# EAGLE schematic bump-sensor (EAGLE 7.2.0)
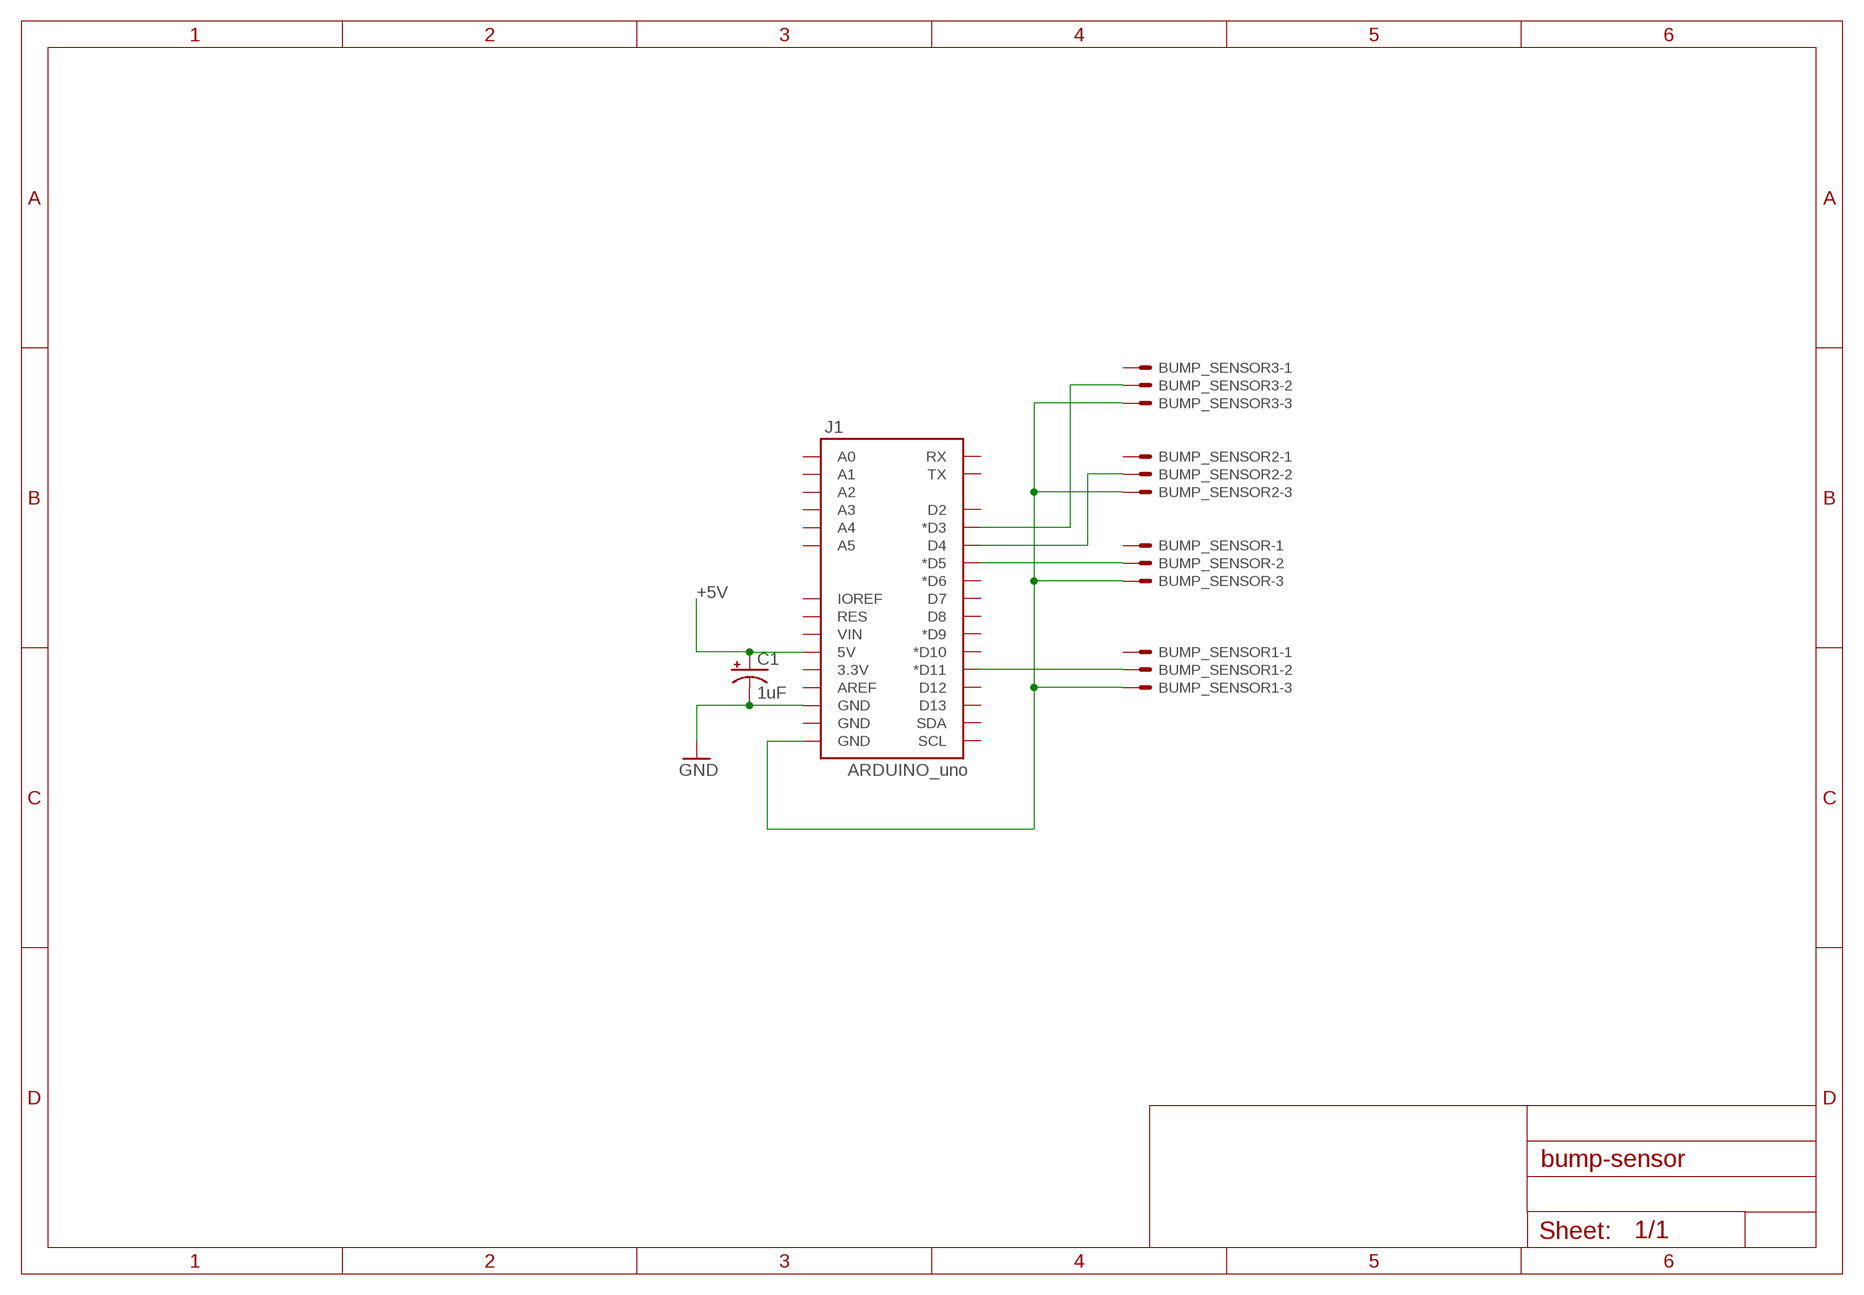
[diagram p0: schematic, sheet 1]

## Parts
BUMP_SENSOR  22-23-2031  [22-23-2031]
BUMP_SENSOR1  22-23-2031  [22-23-2031]
BUMP_SENSOR2  22-23-2031  [22-23-2031]
BUMP_SENSOR3  22-23-2031  [22-23-2031]
C1  1uF  CAP_POL1206  [EIA3216]
J1  ARDUINO_uno  ARDUINO_R3_SHIELD  [UNO_R3_SHIELD]

## Nets
+5V: C1.A(+) J1.5V
GND: C1.C(-) J1.GND@2(GND)
N$1: BUMP_SENSOR1.2 J1.D11(*D11)
N$2: BUMP_SENSOR.2 J1.D5(*D5)
N$3: BUMP_SENSOR1.3 BUMP_SENSOR2.3 BUMP_SENSOR3.3 BUMP_SENSOR.3 J1.GND@0(GND)
N$6: BUMP_SENSOR2.2 J1.D4
N$7: BUMP_SENSOR3.2 J1.D3(*D3)
Unconnected: BUMP_SENSOR1.1 BUMP_SENSOR2.1 BUMP_SENSOR3.1 BUMP_SENSOR.1 J1.3.3V J1.A0 J1.A1 J1.A2 J1.A3 J1.A4 J1.A5 J1.AREF J1.D2 J1.D6(*D6) J1.D7 J1.D8 J1.D9(*D9) J1.D10(*D10) J1.D12 J1.D13 J1.GND@1(GND) J1.IOREF J1.RES J1.RX J1.SCL J1.SDA J1.TX J1.VIN

## Library data of the parts
BUMP_SENSOR BUMP_SENSOR1-BUMP_SENSOR3 = con-molex:22-23-2031: .100" (2.54mm) Center Header - 3 Pin; MF: MOLEX; MPN: 22-23-2031; OC_FARNELL: 1462950; OC_NEWARK: 30C0862
C1 = ME210Lib_2015_v2:CAP_POL: Capacitor Polarized These are standard SMD and PTH capacitors. Normally 10uF, 47uF, and 100uF in electrolytic and tantalum varieties. Always verify the external diameter of the through hole cap, it varies with capacity, voltage, and manufacturer. The EIA devices should be standard.
J1 = ME210Lib_2015_v2:ARDUINO_R3_SHIELD: Shield form compatible with the Arduino Uno R3.